# EAGLE design audio (EAGLE 7.4.0)
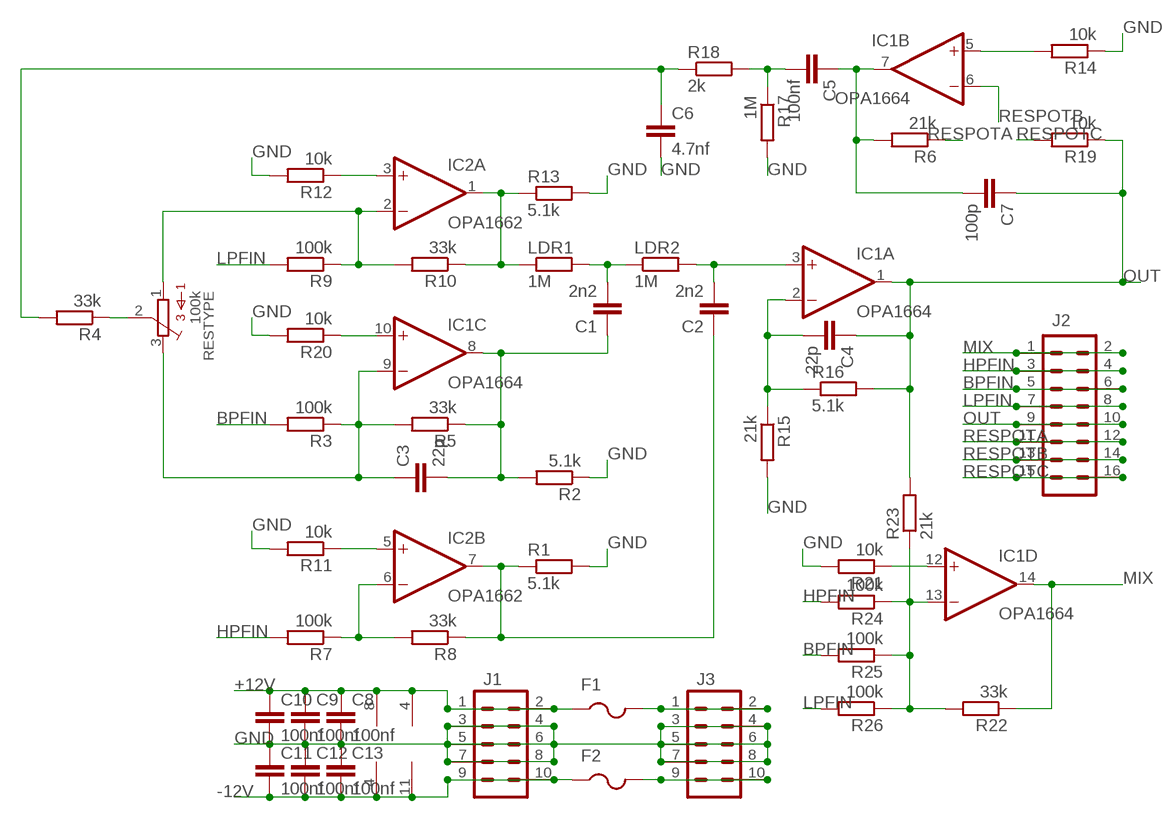
[diagram p0: schematic, sheet 1]

## Parts
C1  2n2  C-EU050-025X075  [C050-025X075]
C2  2n2  C-EU050-025X075  [C050-025X075]
C3  22p  C-EUC1206  [C1206]
C4  22p  C-EUC1206  [C1206]
C5  100nf  C-EUC1206  [C1206]
C6  4.7nf  C-EUC1206  [C1206]
C7  100p  C-EUC1206  [C1206]
C8  100nf  C-EUC1206  [C1206]
C9  100nf  C-EUC1206  [C1206]
C10  100nf  C-EUC1206  [C1206]
C11  100nf  C-EUC1206  [C1206]
C12  100nf  C-EUC1206  [C1206]
C13  100nf  C-EUC1206  [C1206]
F1  PTCFUSE-1206  [R1206]
F2  PTCFUSE-1206  [R1206]
IC1  OPA1664  TL074D  [SO14]
IC2  OPA1662  TL072D  [SO08]
J1  M05X2PTH  [AVR_ICSP]
J2  M08X2  [2X8]
J3  M05X2PTH  [AVR_ICSP]
LDR1  1M  R-EU_0411/3V  [0411V]
LDR2  1M  R-EU_0411/3V  [0411V]
R1  5.1k  R-EU_R1206  [R1206]
R2  5.1k  R-EU_R1206  [R1206]
R3  100k  R-EU_R1206  [R1206]
R4  33k  R-EU_R1206  [R1206]
R5  33k  R-EU_R1206  [R1206]
R6  21k  R-EU_R1206  [R1206]
R7  100k  R-EU_R1206  [R1206]
R8  33k  R-EU_R1206  [R1206]
R9  100k  R-EU_R1206  [R1206]
R10  33k  R-EU_R1206  [R1206]
R11  10k  R-EU_R1206  [R1206]
R12  10k  R-EU_R1206  [R1206]
R13  5.1k  R-EU_R1206  [R1206]
R14  10k  R-EU_R1206  [R1206]
R15  21k  R-EU_R1206  [R1206]
R16  5.1k  R-EU_R1206  [R1206]
R17  1M  R-EU_R1206  [R1206]
R18  2k  R-EU_R1206  [R1206]
R19  10k  R-EU_R1206  [R1206]
R20  10k  R-EU_R1206  [R1206]
R21  10k  R-EU_R1206  [R1206]
R22  33k  R-EU_R1206  [R1206]
R23  21k  R-EU_R1206  [R1206]
R24  100k  R-EU_R1206  [R1206]
R25  100k  R-EU_R1206  [R1206]
R26  100k  R-EU_R1206  [R1206]
RESTYPE  100k  3386-C  [3386C]

## Nets
+12V: C8.1 C9.1 C10.1 F1.1 IC1.4(P:V+) IC2.8(P:V+) J1.1 J1.2
-12V: C11.2 C12.2 C13.2 F2.1 IC1.11(P:V-) IC2.4(P:V-) J1.9 J1.10
BPFIN: J2.5 J2.6 R3.2 R25.2
GND: C6.2 C8.2 C9.2 C10.2 C11.1 C12.1 C13.1 J1.3 J1.4 J1.5 J1.6 J1.7 J1.8 J3.3 J3.4 J3.5 J3.6 J3.7 J3.8 R1.2 R2.1 R11.2 R12.2 R13.2 R14.1 R15.2 R17.2 R20.2 R21.2
HPFIN: J2.3 J2.4 R7.2 R24.2
LPFIN: J2.7 J2.8 R9.2 R26.2
MIX: IC1.14(D:OUT) J2.1 J2.2 R22.1
N$1: IC1.10(C:+IN) R20.1
N$2: C4.2 IC1.2(A:-IN) R15.1 R16.1
N$3: C1.1 C3.2 IC1.8(C:OUT) R2.2 R5.1
N$4: R4.1 RESTYPE.2
N$5: IC1.5(B:+IN) R14.2
N$6: C2.2 IC1.3(A:+IN) LDR2.2
N$7: C1.2 LDR1.2 LDR2.1
N$8: F2.2 J3.9 J3.10
N$10: C3.1 IC1.9(C:-IN) R3.1 R5.2 RESTYPE.3
N$12: F1.2 J3.1 J3.2
N$13: IC2.6(B:-IN) R7.1 R8.2
N$14: C2.1 IC2.7(B:OUT) R1.1 R8.1
N$15: IC2.5(B:+IN) R11.1
N$16: IC2.2(A:-IN) R9.1 R10.2 RESTYPE.1
N$17: IC2.3(A:+IN) R12.1
N$18: IC2.1(A:OUT) LDR1.1 R10.1 R13.1
N$20: C5.1 C7.2 IC1.7(B:OUT) R6.2
N$21: C5.2 R17.1 R18.2
N$22: C6.1 R4.2 R18.1
N$23: IC1.12(D:+IN) R21.1
N$25: IC1.13(D:-IN) R22.2 R23.1 R24.1 R25.1 R26.1
OUT: C4.1 C7.1 IC1.1(A:OUT) J2.9 J2.10 R16.2 R19.1 R23.2
RESPOTA: J2.11 J2.12 R6.1
RESPOTB: IC1.6(B:-IN) J2.13 J2.14
RESPOTC: J2.15 J2.16 R19.2

## Library data of the parts
C1-C13 = resistor:C-EU: CAPACITOR, European symbol
F1 F2 = adafruit:PTCFUSE: PTC fuses, resettable thermistors
IC1 = linear:TL074: OP AMP
IC2 = linear:TL072: OP AMP
J1 J3 = SparkFun-Connectors:M05X2: Header 5x2 Standard 10-pin dual row 0.1" header. Commonly used with AVR-ISP. Use with Spark Fun Electronics SKU: PRT-00778
J2 = SparkFun-Connectors:M08X2: .1" headers, two rows of 8 each
LDR1 LDR2 R1-R26 = resistor:R-EU_: RESISTOR, European symbol
RESTYPE = bourns:3386-: 3386 Series 3/8" Square Trimmer

## Board
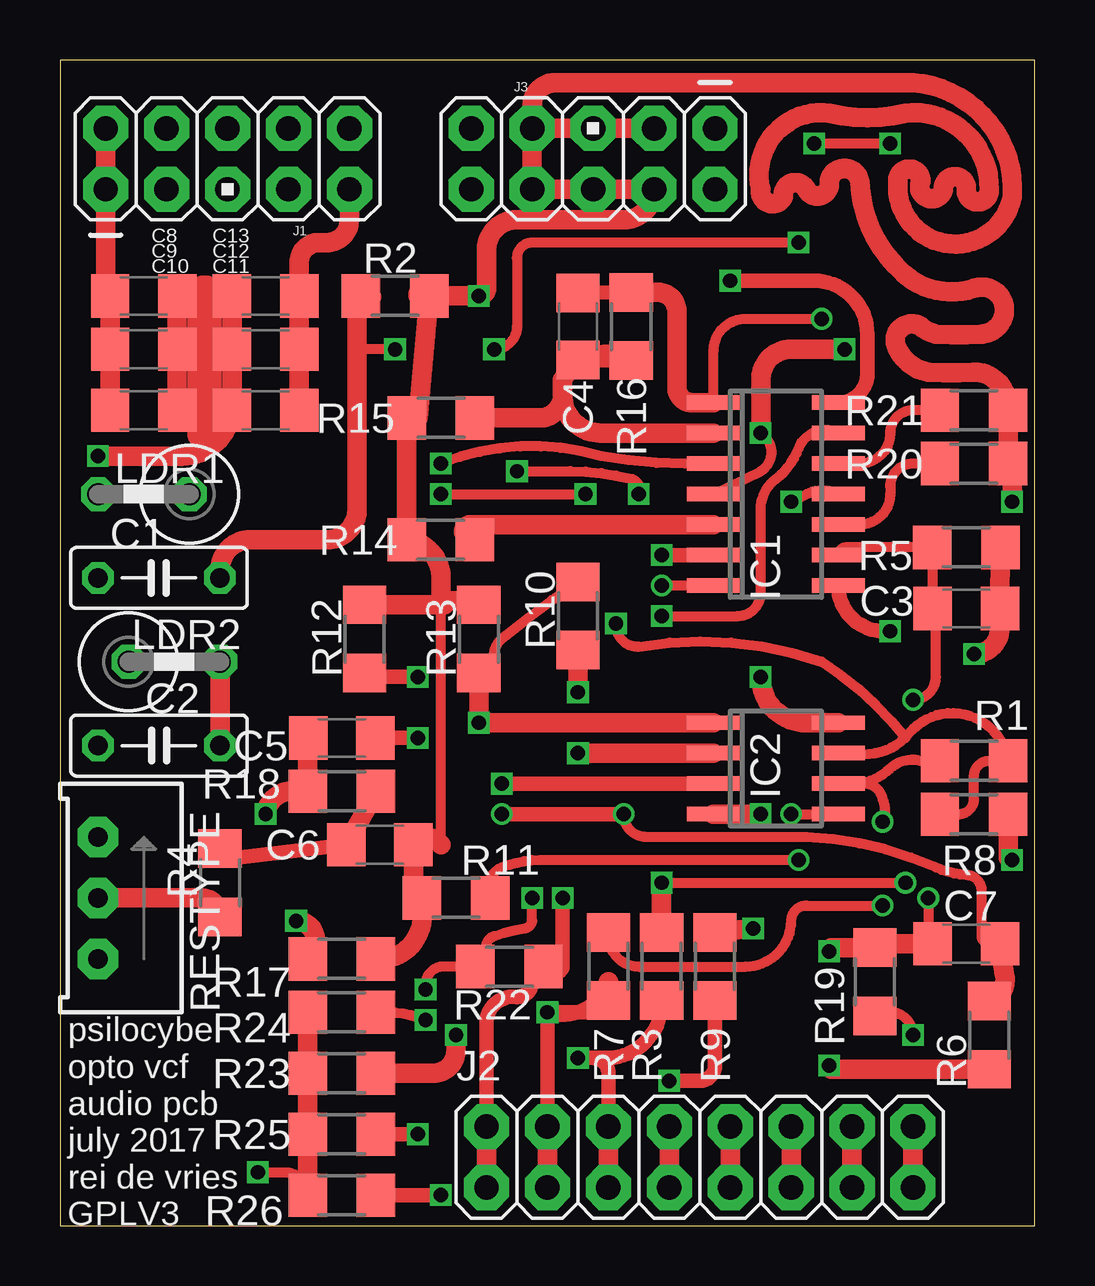
[diagram p1: board, top side]
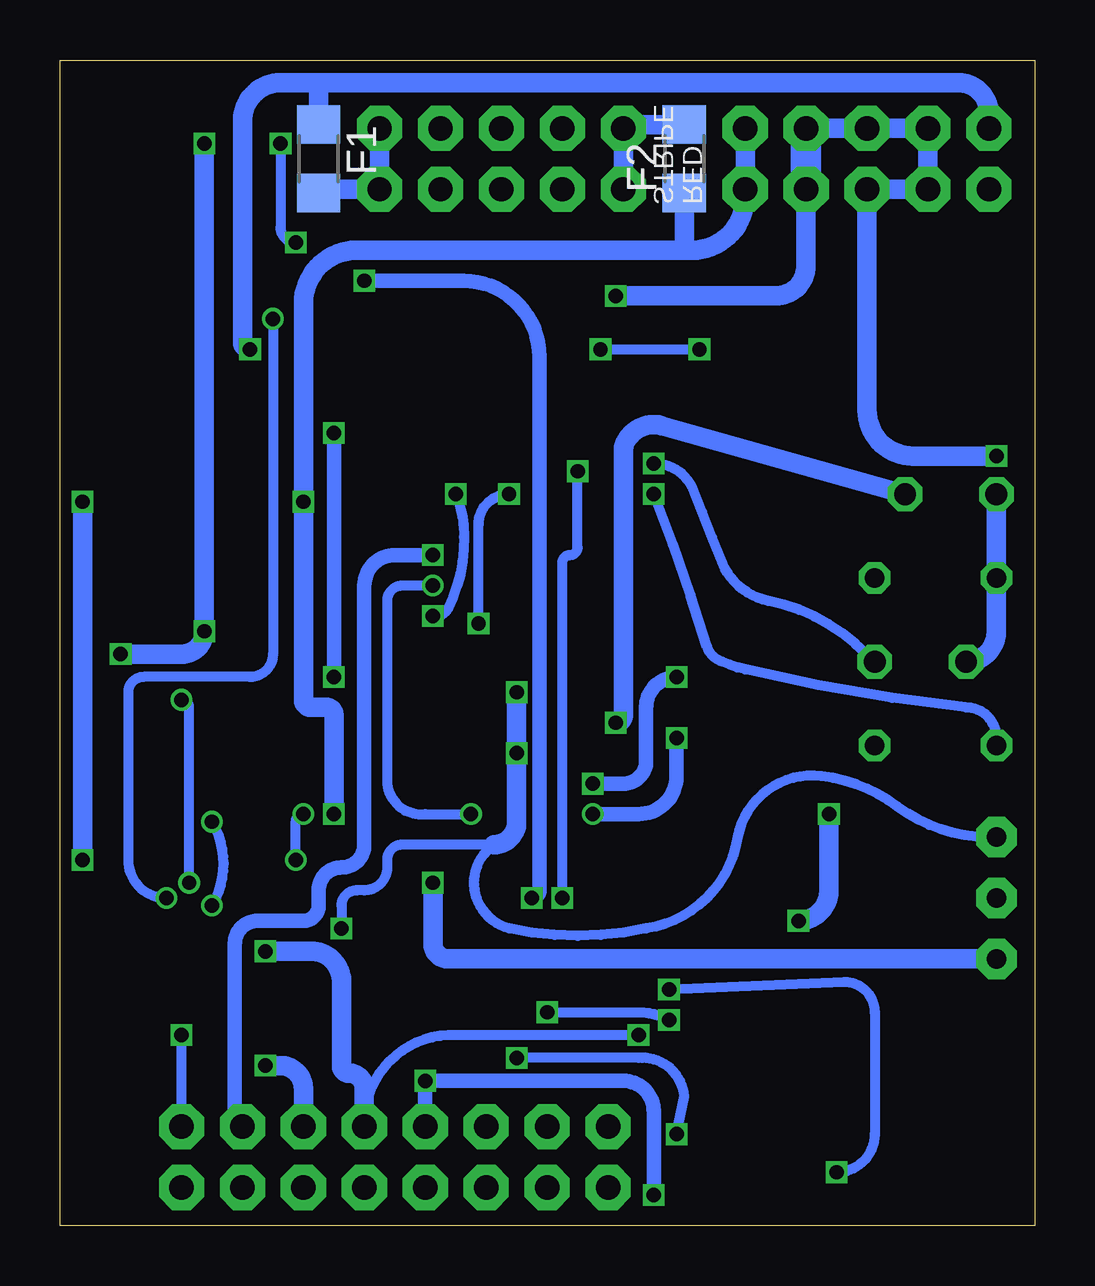
[diagram p2: board, bottom side, seen from below]

Size 40.63 x 48.57 mm. Coordinates in mm from the lower left corner, seen from the top.
Outline: 0,0 40.63,0 40.63,48.57 0,48.57 0,0
Copper layers (1*16): Top 0.035mm / dielectric 1.5mm / Bottom 0.035mm
Design rules "SeeedStudio_2layer_DRU_no_angle_20140221 *": minimum track width 4mil, minimum drill 12mil, track to track 6mil, track to pad 6mil, pad to pad 6mil, via to via 4mil, smd to smd 0mil, copper to edge 10mil, drill to drill 10mil, minimum pad ring 10mil, minimum via ring 6mil, stop-mask expansion 2mil, vias tented up to drill 100mil, thermal gap 10mil

### Footprints (pad centres in the part's own frame; a part is rotated, then mirrored left to right if it is on the bottom)
C050-025X075 = drill 0.813 octagon: 1 -2.54,0; 2 2.54,0
C1206 = smd 1.6 x 1.8: 1 -1.4,0; 2 1.4,0
R1206 = smd 1.6 x 1.803: 1 -1.422,0; 2 1.422,0
SO14 = smd 0.6 x 2.2: 1 -3.81,-2.6; 2 -2.54,-2.6; 3 -1.27,-2.6; 4 0,-2.6; 5 1.27,-2.6; 6 2.54,-2.6; 7 3.81,-2.6; 8 3.81,2.6; 9 2.54,2.6; 10 1.27,2.6; 11 0,2.6; 12 -1.27,2.6; 13 -2.54,2.6; 14 -3.81,2.6
SO08 = smd 0.6 x 2.2: 1 -1.905,-2.6; 2 -0.635,-2.6; 3 0.635,-2.6; 4 1.905,-2.6; 5 1.905,2.6; 6 0.635,2.6; 7 -0.635,2.6; 8 -1.905,2.6
AVR_ICSP = drill 1.016 pad 1.88 octagon: 1 -1.27,5.08; 2 1.27,5.08; 3 -1.27,2.54; 4 1.27,2.54; 5 -1.27,0; 6 1.27,0; 7 -1.27,-2.54; 8 1.27,-2.54; 9 -1.27,-5.08; 10 1.27,-5.08
2X8 = drill 1.016 pad 1.88 octagon: 1 0,0; 2 0,2.54; 3 2.54,0; 4 2.54,2.54; 5 5.08,0; 6 5.08,2.54; 7 7.62,0; 8 7.62,2.54; 9 10.16,0; 10 10.16,2.54; 11 12.7,0; 12 12.7,2.54; 13 15.24,0; 14 15.24,2.54; 15 17.78,0; 16 17.78,2.54
0411V = drill 0.914 octagon: 1 -2.54,0; 2 1.27,0
3386C = drill 0.813 pad 1.676 octagon: 1 2.54,1.27; 2 0,1.27; 3 -2.54,1.27

### Placement (x,y rotation side)
C1  4.13,26.99 180 top
C2  4.13,20 0 top
C3  37.78,25.72 0 top
C4  21.59,37.47 270 top
C5  11.75,20.32 180 top
C6  13.34,15.88 0 top
C7  37.78,11.75 0 top
C8  3.49,38.73 0 top
C9  3.49,36.51 0 top
C10  3.49,33.97 0 top
C11  8.57,33.97 0 top
C12  8.57,36.51 0 top
C13  8.57,38.73 0 top
F1  29.84,44.45 270 bottom
F2  14.61,44.45 90 bottom
IC1  29.84,30.48 270 top
IC2  29.84,19.05 270 top
J1  6.99,44.45 90 top
J2  17.78,1.59 0 top
J3  22.23,44.45 270 top
LDR1  2.86,30.48 180 top
LDR2  5.4,23.5 0 top
R1  38.1,17.14 0 top
R2  13.97,38.73 180 top
R3  25.08,10.79 270 top
R4  6.67,14.29 90 top
R5  37.78,28.26 180 top
R6  38.73,7.94 90 top
R7  22.86,10.79 270 top
R8  38.1,19.37 180 top
R9  27.3,10.79 270 top
R10  21.59,25.4 270 top
R11  16.51,13.65 180 top
R12  12.7,24.45 90 top
R13  17.46,24.45 90 top
R14  15.88,28.57 0 top
R15  15.88,33.66 180 top
R16  23.81,37.47 90 top
R17  11.75,11.11 0 top
R18  11.75,18.1 180 top
R19  33.97,10.16 270 top
R20  38.1,31.75 0 top
R21  38.1,33.97 0 top
R22  18.73,10.79 180 top
R23  11.75,6.35 0 top
R24  11.75,8.89 0 top
R25  11.75,3.81 0 top
R26  11.75,1.27 0 top
RESTYPE  2.86,13.65 90 top

### Tracks (layer width: path | path; a pad name or v marks a point on that pad's centre or on a via)
+12V  (via drill 0.6)
  Top 0.406: IC1.4 29.21,31.43 arc118 v29.21,33.02
  Top 0.813: J1.2 J1.1 1.91,39.24 arc90 C8.1 C9.1 C10.1 | v32.7,36.51 30.48,36.51 arc90 29.21,35.24 v29.21,33.02 | v29.21,22.86 arc90 31.11,20.95 IC2.8
  Top 1.27: J1.2 1.91,46.04
  Bottom 0.61: v29.21,22.86 v29.21,33.02
  Bottom 0.813: 29.53,47.62 31.43,47.62 arc-90 33.02,46.04 33.02,36.83 arc-90 v32.7,36.51 | 29.53,47.62 3.17,47.62 arc90 1.91,46.35 J1.2 | F1.1 29.84,47.31 arc90 29.53,47.62
-12V  (via drill 0.6)
  Top 0.406: v30.48,30.16 31.11,30.48 arc-53 IC1.11
  Top 0.813: C11.2 C12.2 C13.2 9.97,40.13 arc-90 10.79,40.96 11.11,40.96 arc90 12.06,41.91 J1.9 | IC2.4 v29.21,17.14
  Bottom 0.813: 14.61,40.64 14.29,40.64 arc-90 12.06,42.86 J1.10 J1.9 | 14.61,40.64 28.26,40.64 arc-90 30.48,38.42 v30.48,30.16 30.48,21.91 arc-90 30.16,21.59 29.53,21.59 arc90 29.21,21.27 v29.21,17.14 | F2.1 14.61,40.64
BPFIN  (via drill 0.6)
  Top 0.61: R25.2 v14.92,3.81 | J2.6 22.86,6.35 arc90 22.23,6.99 v21.59,6.99 22.86,6.99 arc90 R3.2
  Top 0.813: J2.6 J2.5
  Bottom 0.406: v14.92,3.81 14.61,5.4 arc-90 16.51,6.99 v21.59,6.99
GND  (via drill 0.6)
  Top 0.406: 15.88,15.88 15.88,26.04
  Top 0.813: C10.2 C9.2 C8.2 arc-90 6.03,37.91 6.03,32.83 | 7.17,34.16 C11.1 arc90 6.03,32.83 | 7.17,34.16 C12.1 C13.1 | v39.69,30.16 39.69,31.58 arc90 R20.2 R21.2 39.52,34.14 arc90 38.1,35.56 arc-5 36.2,35.56 arc-54 34.92,36.51 arc-156 35.88,37.47 arc29 36.51,37.15 arc7 38.42,37.15 arc83 39.37,38.1 arc114 38.1,39.05 arc-50 35.56,39.37 arc-52 33.34,43.5 arc165 32.07,43.5 arc-165 31.11,43.18 arc165 30.16,42.86 arc-165 29.21,43.18 arc-111 32.07,46.35 arc26 35.24,46.35 arc-97 38.73,43.18 arc-191 37.78,43.18 arc191 36.83,43.18 arc-191 35.88,43.5 arc191 34.92,43.5 arc174 39.69,42.86 arc90 35.56,47.62 20.64,47.62 arc90 19.68,46.67 J3.7 | v39.69,15.24 arc-90 39.52,15.4 R1.2 | R17.2 arc90 15.09,12.71 R11.2 arc-90 14.73,14.01 C6.2 14.73,16 arc-90 15.88,15.88 | 15.88,26.04 15.88,26.84 arc90 R14.1 R15.2 arc-90 14.92,33.66 R2.1 arc90 15.24,39.05 arc90 14.92,38.74 14.92,38.73 v17.46,38.73 arc90 17.78,39.05 17.78,40.64 arc-90 19.05,41.91 23.5,41.91 arc90 J3.4 J3.8 | R12.2 16.03,25.87 arc90 15.88,26.04 | 15.88,26.04 17.3,26.04 arc-90 R13.2 | 6.03,32.7 arc-90 5.71,33.02 5.71,39.05 arc-90 6.35,39.05 6.35,33.02 arc-90 6.03,32.7 | 6.03,32.7 6.03,32.83 | 7.17,34.16 arc-90 5.08,32.07 v1.59,32.07 | J3.3 J3.5 J3.7 | J3.8 J3.7 | J3.8 J3.6
  Bottom 0.813: J1.8 J1.6 J1.4 J1.3 J1.5 6.99,33.97 arc-90 5.08,32.07 v1.59,32.07 | J1.7 9.53,40.01 arc90 10.79,38.73 v17.46,38.73 | v39.69,30.16 v39.69,15.24
  Bottom 1.27: J1.8 J1.7
HPFIN  (via drill 0.6)
  Top 0.406: R24.2 13.65,8.89 arc-23 v15.24,8.57
  Top 0.61: v20.32,8.89 arc90 22.86,10.16 22.86,9.53 arc-90 R7.2 | 22.86,9.53 arc-90 22.54,8.89 v20.32,8.89 | v20.32,8.89 J2.4
  Top 0.813: J2.3 J2.4 | 22.86,10.16 22.86,9.53 R7.2
  Bottom 0.406: v20.32,8.89 16.51,8.89 arc28 v15.24,8.57
LPFIN  (via drill 0.6)
  Top 0.61: R26.2 v15.88,1.27 | v25.4,6.03 26.67,6.03 arc90 27.3,6.67 R9.2
  Top 0.813: J2.7 J2.8
  Bottom 0.61: v15.88,1.27 15.88,4.76 arc-90 17.14,6.03 v25.4,6.03 J2.8
MIX  (via drill 0.6)
  Top 0.61: v20.95,13.65 arc-90 v20.95,13.65 20.95,10.79 arc-90 20.32,10.48 R22.1 19.68,10.16 arc-90 19.05,9.53 arc90 17.78,8.57 17.78,3.49 | v27.94,39.37 31.43,39.37 arc-90 33.66,37.15 33.66,35.5 arc-90 IC1.14
  Top 0.813: J2.1 17.78,3.49 J2.2
  Bottom 0.61: v27.94,39.37 23.81,39.37 arc90 20.64,36.2 20.64,13.97 arc90 v20.95,13.65
N$1
  Top 0.406: R20.1 35.56,31.75 arc90 34.61,30.8 34.61,30.48 arc-90 33.34,29.21 IC1.10
N$2
  Top 0.61: C4.2 R16.1
  Top 0.813: IC1.2 22.54,33.02 arc-90 20.95,34.61 | 20.95,34.61 20.95,35.24 arc-90 R16.1 | R15.1 20,33.66 arc90 20.95,34.61
N$3  (via drill 0.6)
  Top 0.102: 13.21,38.99 R2.2
  Top 0.152: 12.98,38.71 R2.2
  Top 0.406: 32.38,26.61 arc-90 IC1.8 | v34.61,45.09 v31.43,45.09 | v30.8,40.96 19.68,40.96 arc90 19.05,40.32 19.05,37.47 arc-90 v18.1,36.51 | v13.97,36.51 12.7,36.51 arc90 12.38,36.2
  Top 0.61: v34.61,24.77 34.35,24.77 arc-90 IC1.8
  Top 0.813: R5.1 C3.2 39.18,24.89 arc-90 v38.1,23.81 | C1.1 6.67,27.3 arc-90 7.94,28.57 11.11,28.57 arc90 12.38,29.84 12.38,36.2 12.38,38.57 arc-90 R2.2 | 12.98,38.71 12.41,38.71 arc-90 12.38,38.73
  Bottom 0.406: v31.43,45.09 31.43,41.59 arc-90 v30.8,40.96 | v18.1,36.51 v13.97,36.51
  Bottom 0.813: v38.1,23.81 35.56,23.81 arc-90 v34.61,24.77 v34.61,45.09
N$4
  Top 0.813: RESTYPE.2 5.88,13.65 arc-90 R4.1
N$5
  Top 0.813: R14.2 16.82,28.89 arc-90 17.14,29.21 IC1.5
N$6  (via drill 0.6)
  Top 0.406: IC1.3 26.04,31.75 arc-10 22.54,32.07 arc38 v15.88,31.75
  Top 0.813: LDR2.2 C2.2
  Bottom 0.406: LDR2.2 6.99,23.81 arc-33 11.11,26.04 arc56 13.02,27.62 arc0 14.29,30.8 arc-63 v15.88,31.75
N$7
  Bottom 0.813: LDR2.1 arc-90 1.59,24.77 C1.2 LDR1.2
N$8
  Bottom 0.813: F2.2 16.99,45.87 arc-90 J3.9 J3.10
N$10  (via drill 0.6)
  Top 0.102: 36.32,25.53 C3.1
  Top 0.406: IC1.9 arc-90 32.76,28.26 R5.2 arc-90 36.38,28.23 C3.1 arc-90 36.51,25.59 36.51,22.86 arc-90 v35.56,21.91 | v25.08,14.29 v35.24,14.29
  Top 0.813: v25.08,14.29 R3.1
  Bottom 0.406: v35.24,14.29 35.24,21.59 arc-90 v35.56,21.91
  Bottom 0.813: RESTYPE.3 24.45,11.11 arc90 25.08,11.75 v25.08,14.29
N$12
  Bottom 0.813: J3.1 J3.2 29.69,43.18 arc-90 F1.2
N$13  (via drill 0.6)
  Top 0.406: R8.2 35.88,19.37 arc59 34.61,19.05 arc-44 33.02,18.41 IC2.6 33.34,18.41 arc-90 34.29,17.78 arc-51 v34.29,16.83 | R7.1 22.86,12.06 arc90 24.13,10.79 28.57,10.79 arc90 30.48,12.7 arc-90 31.11,13.34 v34.29,13.34
  Bottom 0.406: v34.29,13.34 arc-62 v34.29,16.83
N$14  (via drill 0.6)
  Top 0.406: R1.1 37.47,17.14 arc90 38.1,17.78 38.1,18.73 arc-90 38.73,19.37 R8.1 arc137 35.24,20.32 | IC2.7 33.02,19.68 arc53 35.24,20.32 | v23.18,25.08 arc97 24.13,24.13 arc-29 31.75,23.5 arc-19 35.24,20.32 | v15.88,30.48 v21.91,30.48
  Bottom 0.406: C2.1 1.59,20.32 arc-90 2.86,21.59 arc7 12.06,23.18 arc10 13.02,23.5 arc56 13.65,24.13 arc-5 v15.88,30.48 | v23.18,25.08 23.18,29.21 arc90 v21.91,30.48
N$15  (via drill 0.6)
  Top 0.406: 33.02,17.14 IC2.5 v30.48,17.14 | R11.1 17.93,13.8 arc-90 18.41,14.92 arc-24 20.32,15.24 v30.8,15.24
  Bottom 0.406: v30.8,15.24 30.8,16.83 arc90 v30.48,17.14
N$16  (via drill 0.6)
  Top 0.813: IC2.2 v21.59,19.68 | v21.59,22.23 R10.2 | v28.89,12.38 R9.1
  Bottom 0.406: RESTYPE.1 1.91,16.19 arc37 5.71,17.46 arc-30 8.89,18.73 arc-86 12.38,16.19 arc73 16.19,12.38 arc24 21.91,12.38 arc129 22.54,15.88 26.35,15.88 arc-90 26.99,15.24 26.99,14.92 arc90 27.94,13.97 28.26,13.97 arc-90 28.89,13.34 v28.89,12.38
  Bottom 0.813: v21.59,22.23 v21.59,19.68 21.59,16.83 arc90 22.54,15.88
N$17  (via drill 0.6)
  Top 0.61: R12.1 arc90 12.87,22.86 v14.92,22.86 | v18.41,18.41 IC2.3
  Bottom 0.61: v14.92,22.86 arc-90 16.19,21.59 16.19,19.37 arc90 17.14,18.41 v18.41,18.41
N$18  (via drill 0.6)
  Top 0.102: 21.34,26.8 21.59,26.8 R10.1 | 17.78,23.24 R13.1
  Top 0.406: 17.78,23.24 arc54 18.1,23.81 arc-49 18.41,24.45 arc-5 R10.1
  Top 0.813: R13.1 v17.46,20.95 IC2.1
  Bottom 0.813: LDR1.1 15.56,33.34 arc-90 17.14,32.38 17.14,21.27 arc90 v17.46,20.95
N$20  (via drill 0.6)
  Top 0.406: C7.2 38.73,11.75 arc-90 38.42,12.06 38.42,13.97 arc90 37.78,14.61 arc-19 36.51,14.92 arc22 31.11,16.19 24.45,16.19 arc-90 v23.5,17.14 | IC1.7 v25.08,26.67
  Top 0.61: v14.92,20.32 C5.1 | v18.41,17.14 v23.5,17.14
  Top 0.813: C7.2 39.37,10.47 arc-90 R6.2
  Bottom 0.406: v25.08,26.67 26.35,26.67 arc-90 26.99,26.04 26.99,18.41 arc-90 25.4,17.14 v23.5,17.14
  Bottom 0.61: v14.92,20.32 14.92,18.73 arc90 16.51,17.14 v18.41,17.14
N$21  (via drill 0.6)
  Top 0.813: C5.2 arc90 10.32,20.3 R18.2 9.84,18.1 arc90 v8.57,17.14 | R17.1 10.64,11.9 arc90 v9.84,12.7
  Bottom 0.813: v9.84,12.7 arc-90 8.57,13.97 v8.57,17.14
N$22
  Top 0.61: C6.1 6.67,15.24 arc90 R4.2
  Top 0.813: C6.1 13.02,17.77 arc90 R18.1
N$23
  Top 0.406: R21.1 35.56,33.97 arc90 34.61,33.02 arc-90 33.34,31.75 IC1.12
N$25  (via drill 0.6)
  Top 0.406: v15.24,9.84 arc-90 15.88,10.79 R22.2 arc107 17.78,11.43 arc-87 18.1,12.06 arc-12 19.37,12.38 arc74 19.68,12.7 v19.68,13.65 | v8.26,2.22 9.37,2.22 arc-90 R26.1 | v19.05,31.43 21.27,31.43 arc-14 23.81,31.11 arc-98 v24.13,30.48 | v25.08,25.4 28.26,25.4 arc90 29.21,26.35 29.21,29.84 arc-53 29.84,31.11 arc33 30.8,32.38 arc-97 IC1.13
  Top 0.813: R26.1 R25.1 R23.1 R24.1
  Bottom 0.406: v15.24,9.84 7.94,10.16 arc90 6.67,8.89 6.67,3.81 arc90 v8.26,2.22 | v19.68,13.65 19.68,27.62 arc90 19.37,27.94 arc-90 19.05,28.26 v19.05,31.43 | v24.13,30.48 arc17 23.81,29.21 arc32 24.45,25.72 arc75 v25.08,25.4
OUT  (via drill 0.6)
  Top 0.406: IC1.1 27.25,36.45 arc-90 28.57,37.78 v31.75,37.78 | v36.2,13.65 36.2,11.94 arc90 C7.1
  Top 0.61: R16.2 C4.1
  Top 0.813: 13.02,6.67 R23.2 15.56,6.35 arc90 16.51,7.3 v16.51,7.94 | J2.10 J2.9 | R16.2 24.93,38.89 arc-90 25.72,38.1 25.72,34.92 arc90 26.35,34.29 IC1.1 | C7.1 34.12,11.75 arc-90 R19.1 32.22,11.58 arc90 v32.07,11.43
  Bottom 0.406: v16.51,7.94 24.45,7.94 arc-90 J2.10 | v31.75,37.78 31.75,23.81 arc90 32.7,22.86 37.15,22.86 arc-90 37.78,22.23 37.78,15.24 arc-90 v36.2,13.65
  Bottom 0.813: v32.07,11.43 30.16,11.43 arc90 28.89,10.16 28.89,6.67 arc-90 28.57,6.35 arc90 27.94,5.71 J2.10
RESPOTA  (via drill 0.6)
  Top 0.813: J2.12 J2.11 | R6.1 32.22,6.52 arc-90 v32.07,6.67
  Bottom 0.813: v32.07,6.67 31.43,6.67 arc90 30.48,5.71 J2.12
RESPOTB  (via drill 0.6)
  Top 0.61: v25.08,27.94 IC1.6
  Top 0.813: J2.13 J2.14
  Bottom 0.61: v25.08,27.94 26.67,27.94 arc-90 27.94,26.67 27.94,15.88 arc90 28.89,14.92 arc-90 29.84,13.97 29.84,13.34 arc90 30.48,12.7 32.38,12.7 arc-90 33.34,11.75 33.34,4.45 arc-90 J2.14
RESPOTC  (via drill 0.6)
  Top 0.406: v35.56,7.94 arc90 34.61,8.89 34.12,8.89 arc90 R19.2
  Top 0.813: J2.15 J2.16
  Bottom 0.406: J2.16 v35.56,7.94

### Text on the board
tNames: psilocybe / opto vcf / audio pcb / july 2017 / rei de vries / GPLV3
bNames: RED / STRIPE